# Altium schematic sheet dsp_power.SchDoc
size A4; SheetNumber: 7; SheetTotal: 10
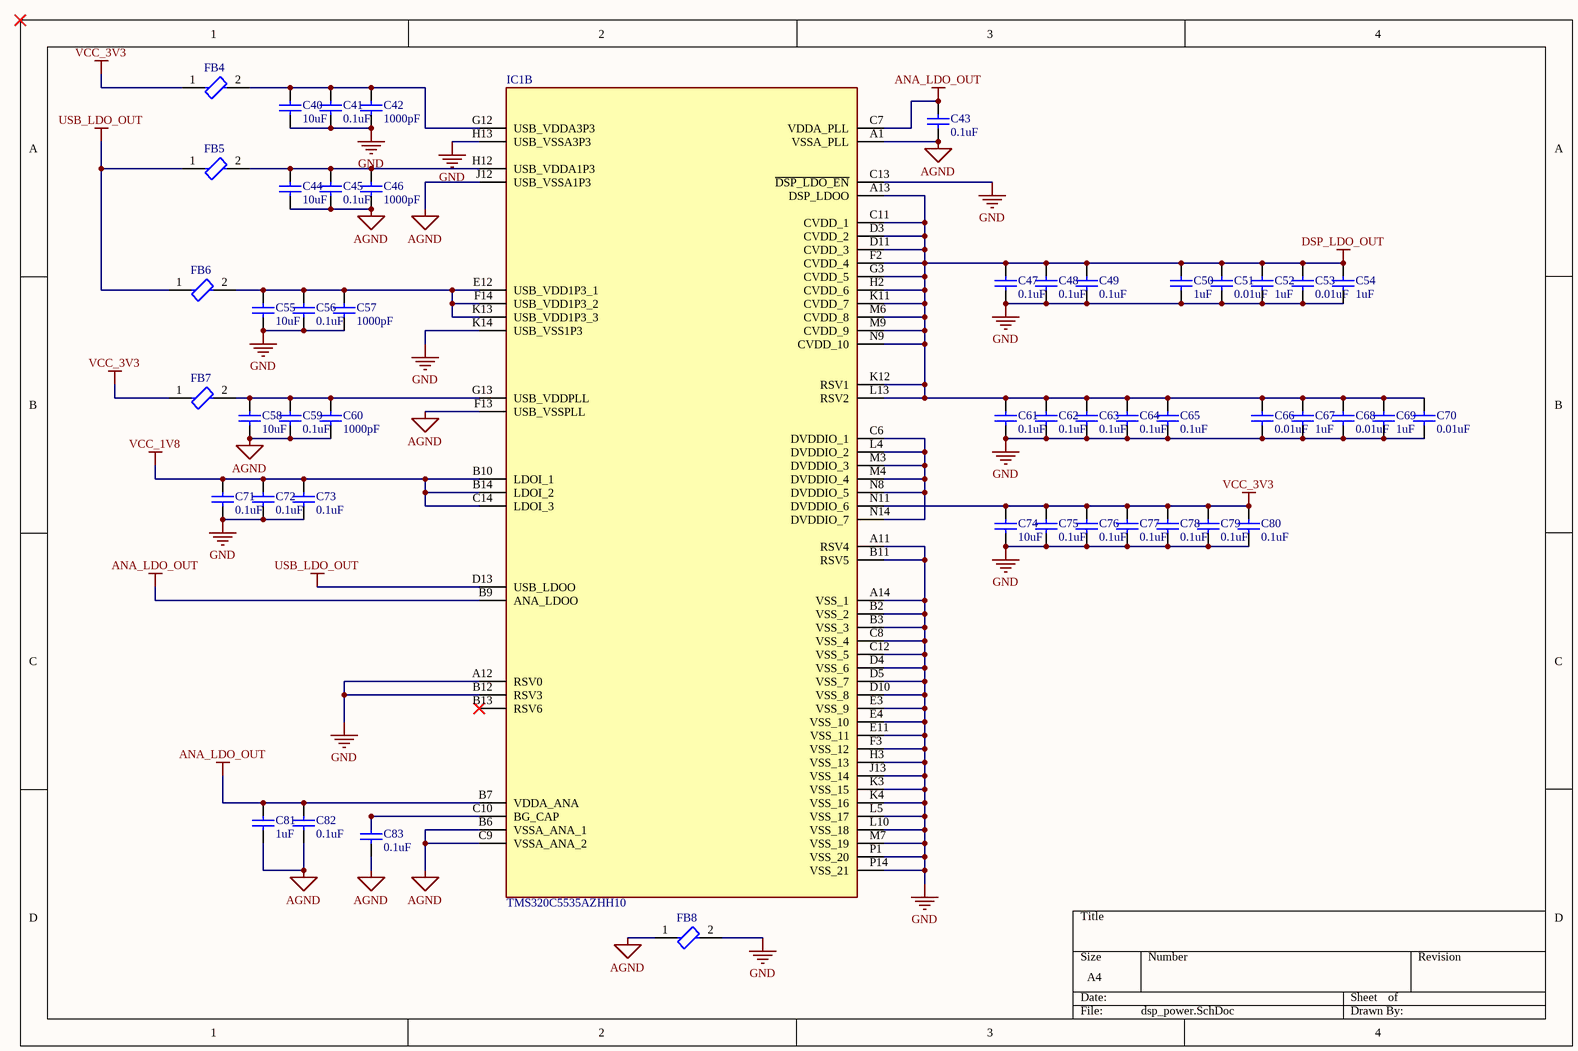
[diagram p0: dsp_power.SchDoc]

## Parts
C40  10uF  [0805_C_S]
C41  0.1uF  [0805_C_S]
C42  1000pF  [0805_C_S]
C43  0.1uF  [0805_C_S]
C44  10uF  [0805_C_S]
C45  0.1uF  [0805_C_S]
C46  1000pF  [0805_C_S]
C47  0.1uF  [0805_C_S]
C48  0.1uF  [0805_C_S]
C49  0.1uF  [0805_C_S]
C50  1uF  [0805_C_S]
C51  0.01uF  [0805_C_S]
C52  1uF  [0805_C_S]
C53  0.01uF  [0805_C_S]
C54  1uF  [0805_C_S]
C55  10uF  [0805_C_S]
C56  0.1uF  [0805_C_S]
C57  1000pF  [0805_C_S]
C58  10uF  [0805_C_S]
C59  0.1uF  [0805_C_S]
C60  1000pF  [0805_C_S]
C61  0.1uF  [0805_C_S]
C62  0.1uF  [0805_C_S]
C63  0.1uF  [0805_C_S]
C64  0.1uF  [0805_C_S]
C65  0.1uF  [0805_C_S]
C66  0.01uF  [0805_C_S]
C67  1uF  [0805_C_S]
C68  0.01uF  [0805_C_S]
C69  1uF  [0805_C_S]
C70  0.01uF  [0805_C_S]
C71  0.1uF  [0805_C_S]
C72  0.1uF  [0805_C_S]
C73  0.1uF  [0805_C_S]
C74  10uF  [0805_C_S]
C75  0.1uF  [0805_C_S]
C76  0.1uF  [0805_C_S]
C77  0.1uF  [0805_C_S]
C78  0.1uF  [0805_C_S]
C79  0.1uF  [0805_C_S]
C80  0.1uF  [0805_C_S]
C81  1uF  [0805_C_S]
C82  0.1uF  [0805_C_S]
C83  0.1uF  [0805_C_S]
FB4  BLM21AG151SN1D  [FP-BLM21-0_2-t0_85-e0_5-MFG]  (value not drawn)
FB5  BLM21AG151SN1D  [FP-BLM21-0_2-t0_85-e0_5-MFG]  (value not drawn)
FB6  BLM21AG151SN1D  [FP-BLM21-0_2-t0_85-e0_5-MFG]  (value not drawn)
FB7  BLM21AG151SN1D  [FP-BLM21-0_2-t0_85-e0_5-MFG]  (value not drawn)
FB8  BLM21AG151SN1D  [FP-BLM21-0_2-t0_85-e0_5-MFG]  (value not drawn)
IC1  TMS320C5535AZHH10  [BGA144C80P14X14_1200X1200X140]  (part B of 2)

## Nets
AGND: C43.1 C44.1 C45.1 C46.1 C58.1 C59.1 C60.1 C81.1 C82.1 C83.1 FB8.1 IC1.A1(VSSA_PLL) IC1.B6(VSSA_ANA_1) IC1.C9(VSSA_ANA_2) IC1.F13(USB_VSSPLL) IC1.J12(USB_VSSA1P3)
ANA_LDO_OUT: C43.2 C81.2 C82.2 IC1.B7(VDDA_ANA) IC1.B9(ANA_LDOO) IC1.C7(VDDA_PLL)
DSP_LDO_OUT: C47.2 C48.2 C49.2 C50.2 C51.2 C52.2 C53.2 C54.2 C61.2 C62.2 C63.2 C64.2 C65.2 C66.2 C67.2 C68.2 C69.2 C70.2 IC1.A13(DSP_LDOO) IC1.C11(CVDD_1) IC1.D3(CVDD_2) IC1.D11(CVDD_3) IC1.F2(CVDD_4) IC1.G3(CVDD_5) IC1.H2(CVDD_6) IC1.K11(CVDD_7) IC1.K12(RSV1) IC1.L13(RSV2) IC1.M6(CVDD_8) IC1.M9(CVDD_9) IC1.N9(CVDD_10)
GND: C40.1 C41.1 C42.1 C47.1 C48.1 C49.1 C50.1 C51.1 C52.1 C53.1 C54.1 C55.1 C56.1 C57.1 C61.1 C62.1 C63.1 C64.1 C65.1 C66.1 C67.1 C68.1 C69.1 C70.1 C71.1 C72.1 C73.1 C74.1 C75.1 C76.1 C77.1 C78.1 C79.1 C80.1 FB8.2 IC1.A11(RSV4) IC1.A12(RSV0) IC1.A14(VSS_1) IC1.B2(VSS_2) IC1.B3(VSS_3) IC1.B11(RSV5) IC1.B12(RSV3) IC1.C8(VSS_4) IC1.C12(VSS_5) IC1.C13(~{DSP_LDO_EN}) IC1.D4(VSS_6) IC1.D5(VSS_7) IC1.D10(VSS_8) IC1.E3(VSS_9) IC1.E4(VSS_10) IC1.E11(VSS_11) IC1.F3(VSS_12) IC1.H3(VSS_13) IC1.H13(USB_VSSA3P3) IC1.J13(VSS_14) IC1.K3(VSS_15) IC1.K4(VSS_16) IC1.K14(USB_VSS1P3) IC1.L5(VSS_17) IC1.L10(VSS_18) IC1.M7(VSS_19) IC1.P1(VSS_20) IC1.P14(VSS_21)
USB_LDO_OUT: FB5.1 FB6.1 IC1.D13(USB_LDOO)
VCC_1V8: C71.2 C72.2 C73.2 IC1.B10(LDOI_1) IC1.B14(LDOI_2) IC1.C14(LDOI_3)
VCC_3V3: C74.2 C75.2 C76.2 C77.2 C78.2 C79.2 C80.2 FB4.1 FB7.1 IC1.N11(DVDDIO_6)
NetC40_2: C40.2 C41.2 C42.2 FB4.2 IC1.G12(USB_VDDA3P3)
NetC44_2: C44.2 C45.2 C46.2 FB5.2 IC1.H12(USB_VDDA1P3)
NetC55_2: C55.2 C56.2 C57.2 FB6.2 IC1.E12(USB_VDD1P3_1) IC1.F14(USB_VDD1P3_2) IC1.K13(USB_VDD1P3_3)
NetC58_2: C58.2 C59.2 C60.2 FB7.2 IC1.G13(USB_VDDPLL)
NetC83_2: C83.2 IC1.C10(BG_CAP)
NetIC1_C6: IC1.C6(DVDDIO_1) IC1.L4(DVDDIO_2) IC1.M3(DVDDIO_3) IC1.M4(DVDDIO_4) IC1.N8(DVDDIO_5) IC1.N14(DVDDIO_7)

Not connected (* = marked no-connect by the designer): IC1 B13(RSV6)*

## Library data of the parts
C40-C83 = Cap: Capacitor; Published: 8-Jun-2000; LatestRevisionDate: 17-Jul-2002; LatestRevisionNote: Re-released for DXP Platform.; Publisher: Altium Limited
  C40 C44 C55 C58 C74: Value: 10uF
  C41 C43 C45 C47-C49 C56 C59 C61-C65 C71-C73 C75-C80 C82 C83: Value: 0.1uF
  C42 C46 C57 C60: Value: 1000pF
  C50 C52 C54 C67 C69 C81: Value: 1uF
  C51 C53 C66 C68 C70: Value: 0.01uF
FB4-FB8 = CMP-0686-00717-3: Chip Ferrite Bead, 0805, 150Ω @ 100MHz, 0.09Ω, 25%, 1A; Number of Circuits: 1; Max Current Rating: 800mA; DC Resistance (DCR): 100mR; Shielding: Unshielded; DC Current: 200mA; Impedance: 150R; Contact Plating: Tin; Weight: 0.000194oz; Series: EMIFIL®, BLM21A; Core Material: Ferrite; Test Frequency: 100MHz; Case Code (Metric): 2012; Package Quantity: 4000; Lead Free: Lead Free; Max Operating Temperature: 125°C; Case Code (Imperial): 0805; Material: Ferrite; Min Operating Temperature: -55°C; Tolerance: 25%; Length: 2mm; DC Resistance-Max: 100mR; Width: 1.25mm; RoHS Compliant: Yes; Packaging: Tape and Reel; REACH SVHC: No SVHC; Depth: 1.45mm; Number of Pins: 2; Radiation Hardening: No; Current Rating: 800mA; Height: 0.85mm; Termination: SMD/SMT; Number of Lines: 1; Max DC Current: 200mA; Case/Package: 0805
IC1 = TMS320C5535AZHH10: Integrated Circuit; Manufacturer_Name: Texas Instruments; Datasheet Link: https://www.ti.com/lit/ds/symlink/tms320c5535.pdf?ts=1611725836718&ref_url=https%253A%252F%252Fwww.ti.com%252Fstore%252Fti%252Fen%252Fp%252Fproduct%252F%253Fp%253DTMS320C5535AZAY10; Height: 1.4mm; Manufacturer_Part_Number: TMS320C5535AZHH10; Mouser Part Number: 595-MS320C5535AZHH10; Mouser Price/Stock: https://www.mouser.co.uk/ProductDetail/Texas-Instruments/TMS320C5535AZHH10/?qs=bdKHSS5iKg4ejDTN3zE2OA%3D%3D; Arrow Part Number: TMS320C5535AZHH10; Arrow Price/Stock: https://www.arrow.com/en/products/tms320c5535azhh10/texas-instruments